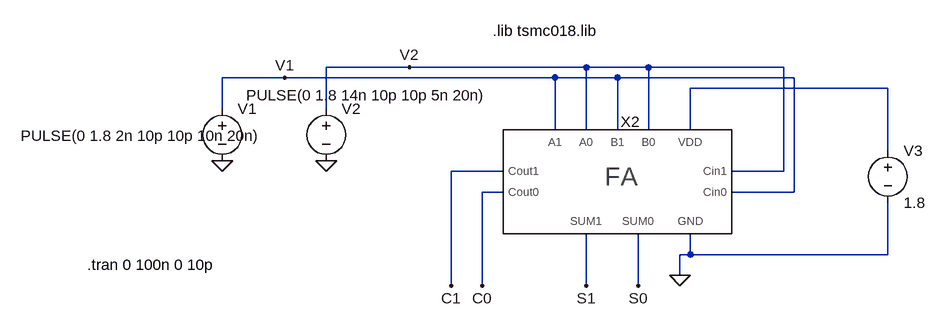
[diagram p0: schematic EFA_test.asc]
EFA_test.asc, the LTspice schematic file:
Version 4
SHEET 1 1344 764
WIRE 544 352 416 352
WIRE 816 352 544 352
WIRE 912 352 816 352
WIRE 1120 352 912 352
WIRE 352 368 256 368
WIRE 768 368 352 368
WIRE 864 368 768 368
WIRE 1136 368 864 368
WIRE 1280 384 976 384
WIRE 256 416 256 368
WIRE 416 416 416 352
WIRE 768 448 768 368
WIRE 816 448 816 352
WIRE 864 448 864 368
WIRE 912 448 912 352
WIRE 976 448 976 384
WIRE 1280 480 1280 384
WIRE 688 512 608 512
WIRE 1120 512 1120 352
WIRE 1120 512 1040 512
WIRE 688 544 656 544
WIRE 1136 544 1136 368
WIRE 1136 544 1040 544
WIRE 976 640 976 608
WIRE 976 640 960 640
WIRE 1280 640 1280 560
WIRE 1280 640 976 640
WIRE 960 672 960 640
WIRE 608 688 608 512
WIRE 656 688 656 544
WIRE 816 688 816 608
WIRE 896 688 896 608
FLAG 960 672 0
FLAG 816 688 S1
FLAG 896 688 S0
FLAG 656 688 C0
FLAG 608 688 C1
FLAG 416 496 0
FLAG 256 496 0
FLAG 352 368 V1
FLAG 544 352 V2
SYMBOL voltage 1280 464 R0
WINDOW 123 0 0 Left 0
WINDOW 39 0 0 Left 0
SYMATTR InstName V3
SYMATTR Value 1.8
SYMBOL EFA 880 560 R0
SYMATTR InstName X2
SYMBOL voltage 256 400 R0
WINDOW 3 -310 57 Left 2
WINDOW 123 0 0 Left 0
WINDOW 39 0 0 Left 0
SYMATTR Value PULSE(0 1.8 2n 10p 10p 10n 20n)
SYMATTR InstName V1
SYMBOL voltage 416 400 R0
WINDOW 3 -123 -5 Left 2
SYMATTR Value PULSE(0 1.8 14n 10p 10p 5n 20n)
SYMATTR InstName V2
TEXT 672 296 Left 2 !.lib tsmc018.lib
TEXT 48 656 Left 2 !.tran 0 100n 0 10p

The netlist it stands for:
* EFA_test.asc
V3 N001 0 1.8
XX2 V2 V1 V2 V1 V1 V2 0 N001 C0 C1 S0 S1 EFA  ; pins A0 A1 B0 B1 Cin0 Cin1 GND VDD Cout0 Cout1 SUM0 SUM1
V1 V1 0 PULSE(0 1.8 2n 10p 10p 10n 20n)
V2 V2 0 PULSE(0 1.8 14n 10p 10p 5n 20n)
.lib tsmc018.lib
.tran 0 100n 0 10p
.backanno
.end